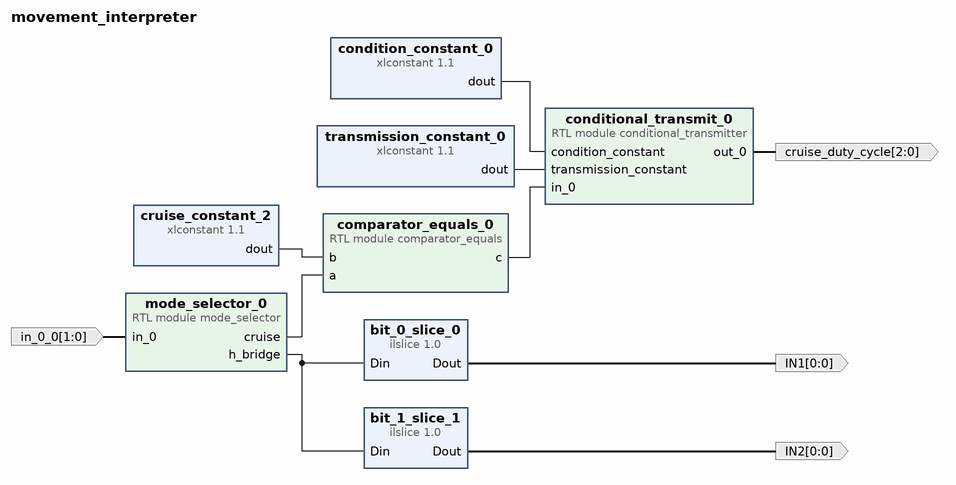
[diagram p0: block diagram of the top level]
# Vivado block design movement_interpreter, xc7z020clg400-1, Vivado 2024.2
create_bd_design movement_interpreter

create_bd_port -dir O -from 0 -to 0 IN2
create_bd_port -dir O -from 0 -to 0 IN1
create_bd_port -dir O -from 2 -to 0 cruise_duty_cycle
create_bd_port -dir I -from 1 -to 0 in_0_0

create_bd_cell -type module -reference mode_selector mode_selector_0
create_bd_cell -type module -reference comparator_equals comparator_equals_0
set_property -dict {CONFIG.n_bits 2} [get_bd_cells comparator_equals_0]
create_bd_cell -type module -reference conditional_transmitter conditional_transmit_0
set_property -dict {CONFIG.n_bits_0 1 CONFIG.n_bits_1 3} [get_bd_cells conditional_transmit_0]
create_bd_cell -type inline_hdl -vlnv xilinx.com:inline_hdl:ilslice:1.0 bit_0_slice_0
set_property -dict {CONFIG.DIN_WIDTH 2} [get_bd_cells bit_0_slice_0]
create_bd_cell -type inline_hdl -vlnv xilinx.com:inline_hdl:ilslice:1.0 bit_1_slice_1
set_property -dict {CONFIG.DIN_FROM 1 CONFIG.DIN_TO 1 CONFIG.DIN_WIDTH 2} [get_bd_cells bit_1_slice_1]
create_bd_cell -type ip -vlnv xilinx.com:ip:xlconstant:1.1 condition_constant_0
set_property -dict {CONFIG.CONST_VAL 1 CONFIG.CONST_WIDTH 1} [get_bd_cells condition_constant_0]
create_bd_cell -type ip -vlnv xilinx.com:ip:xlconstant:1.1 transmission_constant_0
set_property -dict {CONFIG.CONST_VAL 0 CONFIG.CONST_WIDTH 3} [get_bd_cells transmission_constant_0]
create_bd_cell -type ip -vlnv xilinx.com:ip:xlconstant:1.1 cruise_constant_2
set_property -dict {CONFIG.CONST_VAL 3 CONFIG.CONST_WIDTH 4} [get_bd_cells cruise_constant_2]

# ---- connections ----

connect_bd_net [get_bd_pins bit_0_slice_0/Dout] [get_bd_ports IN1]
connect_bd_net [get_bd_pins bit_1_slice_1/Dout] [get_bd_ports IN2]
connect_bd_net [get_bd_pins comparator_equals_0/c] [get_bd_pins conditional_transmit_0/in_0]
connect_bd_net [get_bd_pins conditional_transmit_0/out_0] [get_bd_ports cruise_duty_cycle]
connect_bd_net -net in_0_0_1 [get_bd_ports in_0_0] [get_bd_pins mode_selector_0/in_0]
connect_bd_net [get_bd_pins mode_selector_0/cruise] [get_bd_pins comparator_equals_0/a]
connect_bd_net [get_bd_pins mode_selector_0/h_bridge] [get_bd_pins bit_1_slice_1/Din] [get_bd_pins bit_0_slice_0/Din]
connect_bd_net -net xlconstant_0_dout [get_bd_pins condition_constant_0/dout] [get_bd_pins conditional_transmit_0/condition_constant]
connect_bd_net -net xlconstant_1_dout [get_bd_pins transmission_constant_0/dout] [get_bd_pins conditional_transmit_0/transmission_constant]
connect_bd_net -net xlconstant_2_dout [get_bd_pins cruise_constant_2/dout] [get_bd_pins comparator_equals_0/b]

validate_bd_design
save_bd_design
